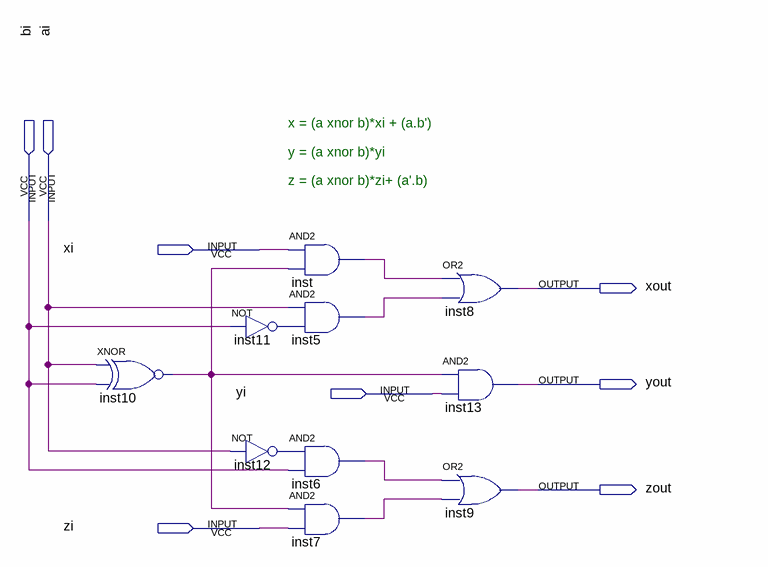
[diagram p0: schematic sheet]
// Quartus schematic CmpDemo.bdf as structural Verilog: 10 symbols, 8 pins
module CmpDemo (
  input  bi,
  input  ai,
  input  xi,
  input  yi,
  input  zi,
  output xout,
  output yout,
  output zout
);

  wire inst5_out, inst6_out, inst7_out, inst10_out, inst11_out, inst12_out, inst_out;

  xnor inst10 (inst10_out, ai, bi);
  not inst11 (inst11_out, bi);
  not inst12 (inst12_out, ai);
  and inst (inst_out, xi, inst10_out);
  and inst5 (inst5_out, ai, inst11_out);
  and inst6 (inst6_out, inst12_out, bi);
  and inst7 (inst7_out, inst10_out, zi);
  or inst8 (xout, inst_out, inst5_out);
  and inst13 (yout, inst10_out, yi);
  or inst9 (zout, inst6_out, inst7_out);

  // Notes on the sheet:
  //   x = (a xnor b)*xi + (a.b')
  //   y = (a xnor b)*yi
  //   z = (a xnor b)*zi+ (a'.b)
endmodule
